# Altium schematic sheet Sheet3.SchDoc
size A3; SheetNumber: 3; SheetTotal: 3
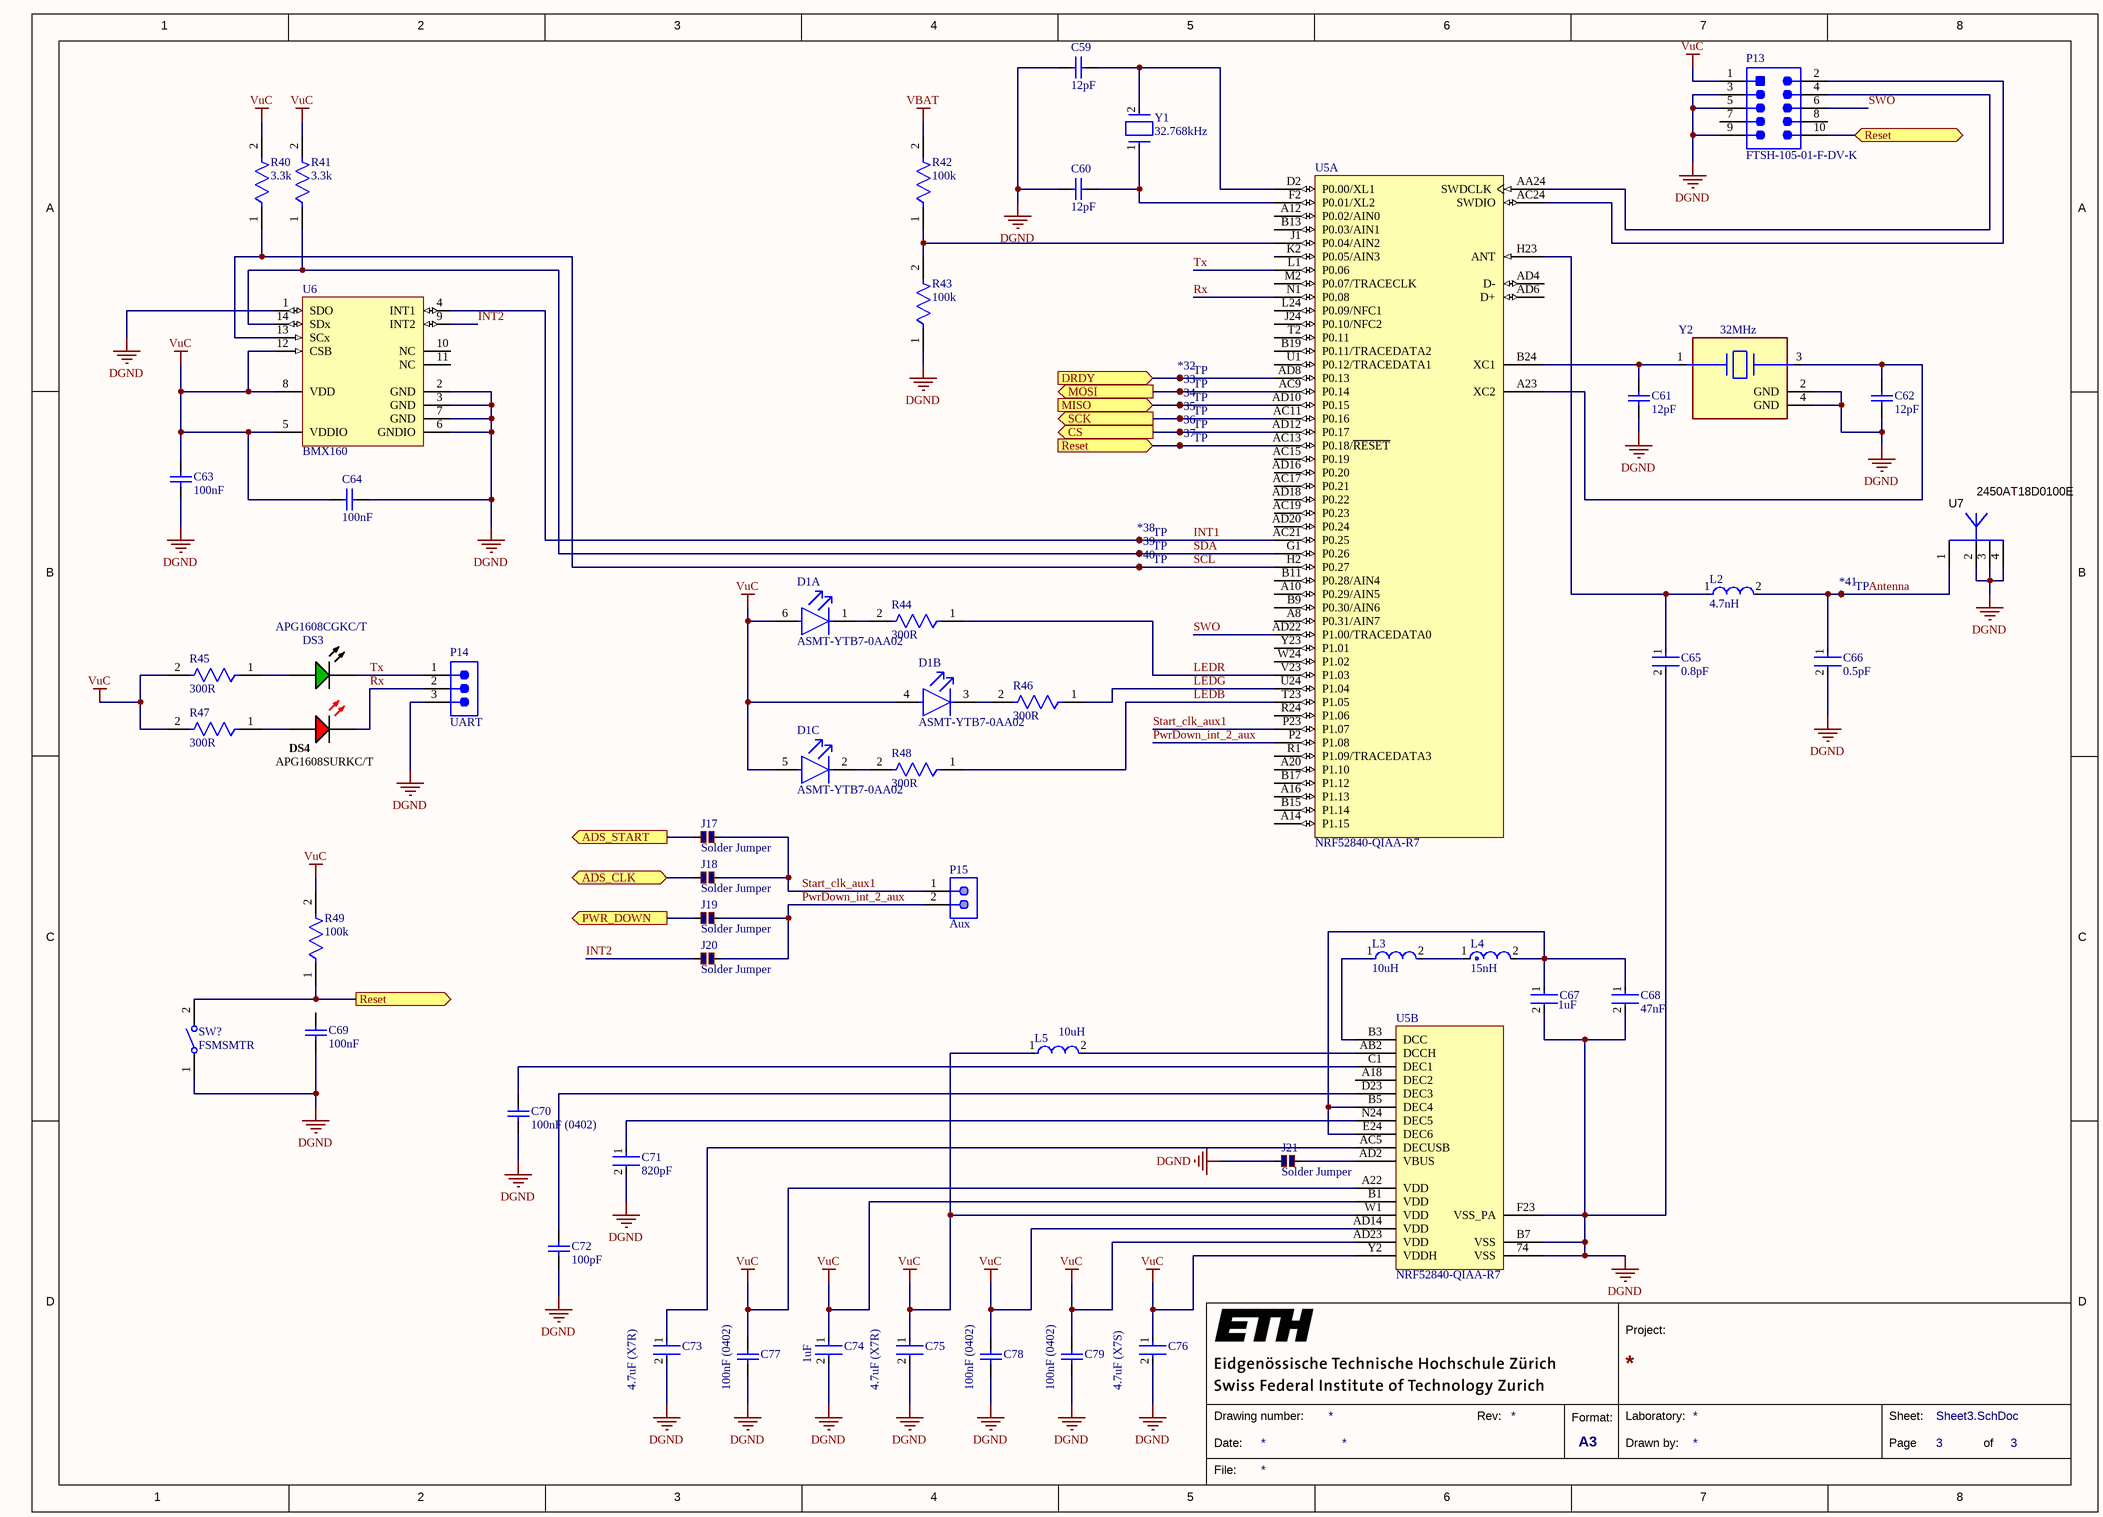
[diagram p0: Sheet3.SchDoc]

## Parts
*32  TP  [Pad-1mm]  (no BOM)
*33  TP  [Pad-1mm]  (no BOM)
*34  TP  [Pad-1mm]  (no BOM)
*35  TP  [Pad-1mm]  (no BOM)
*36  TP  [Pad-1mm]  (no BOM)
*37  TP  [Pad-1mm]  (no BOM)
*38  TP  [Pad-1mm]  (no BOM)
*39  TP  [Pad-1mm]  (no BOM)
*40  TP  [Pad-1mm]  (no BOM)
*41  TP  [Pad-1mm]  (no BOM)
C59  12pF  [CAPC1005X55X25ML05T10]
C60  12pF  [CAPC1005X55X25ML05T10]
C61  12pF  [CAPC1005X55X25ML05T10]
C62  12pF  [CAPC1005X55X25ML05T10]
C63  100nF  [CAPC1608X92X38LL15T08]
C64  100nF  [CAPC1608X92X38LL15T08]
C65  0.8pF  [FP-GJM155-0_05-IPC_A]
C66  0.5pF  [FP-GJM155-0_05-MFG]
C67  1uF  [FP-CL10-IPC_C]
C68  47nF  [FP-GRM155-0_05-IPC_C]
C69  100nF  [CAPC1608X92X38LL15T08]
C70  100nF (0402)  [CAPC1005X55X25ML05T10]
C71  820pF  [FP-GRM155-0_05-IPC_B]
C72  100pF  [CAPC1005X55X10LL05]
C73  4.7uF (X7R)  [FP-CL10-IPC_C]
C74  1uF  [FP-CL10-IPC_C]
C75  4.7uF (X7R)  [FP-CL10-IPC_C]
C76  4.7uF (X7S)  [FP-GRM188-0_15-IPC_A]
C77  100nF (0402)  [CAPC1005X55X25ML05T10]
C78  100nF (0402)  [CAPC1005X55X25ML05T10]
C79  100nF (0402)  [CAPC1005X55X25ML05T10]
D1  ASMT-YTB7-0AA02  [FP-PLCC-6-MFG]  (parts A,B,C of 3)
DS3  APG1608CGKC/T  [KING-LED0603-25-GREEN_V]
DS4  APG1608SURKC/T  [KING-LED0603-25-RED_V]
J17  Solder Jumper  [Small Solder Jumper]
J18  Solder Jumper  [Small Solder Jumper]
J19  Solder Jumper  [Small Solder Jumper]
J20  Solder Jumper  [Small Solder Jumper]
J21  Solder Jumper  [Small Solder Jumper]
L2  4.7nH  [FP-LQW15AN_00-W0_6-0_1-MFG]
L3  10uH  [FP-LQM18FN_00-IPC_C]
L4  15nH  [FP-LQG15HH_02-IPC_B]
L5  10uH  [FP-MLZ1608-MFG]
P13  FTSH-105-01-F-DV-K  [SMTC-FTSH-105-01-L-DV-K_V]
P14  UART  [SMTC-TSW-103-07-X-S]
P15  Aux  [SMTC-TSW-102-07-S-S]
R40  3.3k  [FP-CRCW0603-e3-IPC_A]
R41  3.3k  [FP-CRCW0603-e3-IPC_A]
R42  100k  [FP-CRCW0603-HPe3-IPC_C]
R43  100k  [FP-CRCW0603-HPe3-IPC_C]
R44  300R  [FP-CRCW0603-e3-IPC_A]
R45  300R  [FP-CRCW0603-e3-IPC_A]
R46  300R  [FP-CRCW0603-e3-IPC_A]
R47  300R  [FP-CRCW0603-e3-IPC_A]
R48  300R  [FP-CRCW0603-e3-IPC_A]
R49  100k  [FP-CRCW0603-HPe3-IPC_C]
SW?  FSMSMTR  [TECO-FSMSMTR_V]
U5  NRF52840-QIAA-R7  [NRSC-AQFN-73]  (parts A,B of 2)
U6  BMX160  [LGA-14_2500X3000X860_N]
U7  2450AT18D0100E  [JT-2450AT18D0100E_V]
Y1  32.768kHz  [FP-ECX-34R-MFG]
Y2  32MHz  [FP-402-MFG]

## Ports
ADS_CLK (bidir), ADS_START (out), CS (out), DRDY (in), MISO (in), MOSI (out), PWR_DOWN (out), Reset (bidir), Reset (in), Reset (out), SCK (out)

## Nets
DGND: C59.1 C60.1 C61.1 C62.1 C63.2 C64.2 C65.2 C66.2 C67.2 C68.2 C69.2 C70.1 C71.2 C72.1 C73.2 C74.2 C75.2 C76.2 C77.1 C78.1 C79.1 J21.1 P13.3 P13.5 P13.9 P14.3 R43.1 SW?.1 U5.74(VSS) U5.B7(VSS) U5.F23(VSS_PA) U6.1(SDO) U6.2(GND) U6.3(GND) U6.6(GNDIO) U6.7(GND) U7.2(GND) U7.3(GND) U7.4(GND) Y2.2(GND) Y2.4(GND)
VBAT: R42.2
VuC: C63.1 C64.1 C74.1 C75.1 C76.1 C77.2 C78.2 C79.2 D1.4(Anode(Red)) D1.5(Anode(Green)) D1.6(Anode(Blue)) L5.1 P13.1 R40.2 R41.2 R45.2 R47.2 R49.2 U5.A22(VDD) U5.AD14(VDD) U5.AD23(VDD) U5.B1(VDD) U5.W1(VDD) U5.Y2(VDDH) U6.5(VDDIO) U6.8(VDD) U6.12(CSB)
ADS_CLK: J18.1 ; port ADS_CLK
ADS_START: J17.1 ; port ADS_START
Antenna: *41.1 C66.1 L2.2 U7.1(Feeding_Point)
CS: *36.1 U5.AD12(P0.17) ; port CS
DRDY: *32.1 U5.AD8(P0.13) ; port DRDY
INT1: *38.1 U5.AC21(P0.25) U6.4(INT1)
INT2: J20.1 U6.9(INT2)
LEDB: R48.1 U5.T23(P1.05)
LEDG: R46.1 U5.U24(P1.04)
LEDR: R44.1 U5.V23(P1.03)
MISO: *34.1 U5.AD10(P0.15) ; port MISO
MOSI: *33.1 U5.AC9(P0.14) ; port MOSI
PWR_DOWN: J19.1 ; port PWR_DOWN
PwrDown_int_2_aux: J19.2 J20.2 P15.2 U5.P2(P1.08)
Reset: *37.1 P13.10 R49.1 SW?.2 U5.AC13(P0.18/~{RESET}) ; port Reset
Rx: DS4.2(K) P14.2 U5.N1(P0.08)
SCK: *35.1 U5.AC11(P0.16) ; port SCK
SCL: *40.1 R40.1 U5.H2(P0.27) U6.13(SCx)
SDA: *39.1 R41.1 U5.G1(P0.26) U6.14(SDx)
Start_clk_aux1: J17.2 J18.2 P15.1 U5.P23(P1.07)
SWO: P13.6 U5.AD22(P1.00/TRACEDATA0)
Tx: DS3.2(K) P14.1 U5.L1(P0.06)
NetC59_2: C59.2 U5.D2(P0.00/XL1) Y1.2(Out/In)
NetC60_2: C60.2 U5.F2(P0.01/XL2) Y1.1(In/Out)
NetC61_2: C61.2 U5.B24(XC1) Y2.1
NetC62_2: C62.2 U5.A23(XC2) Y2.3
NetC65_1: C65.1 L2.1 U5.H23(ANT)
NetC67_1: C67.1 C68.1 L4.2 U5.B5(DEC4) U5.E24(DEC6)
NetC70_2: C70.2 U5.C1(DEC1)
NetC71_1: C71.1 U5.N24(DEC5)
NetC72_2: C72.2 U5.D23(DEC3)
NetC73_1: C73.1 U5.AC5(DECUSB)
NetD1_1: D1.1(Cathode(Blue)) R44.2
NetD1_2: D1.2(Cathode(Green)) R48.2
NetD1_3: D1.3(Cathode(Red)) R46.2
NetDS3_1: DS3.1(A) R45.1
NetDS4_1: DS4.1(A) R47.1
NetJ21_2: J21.2 U5.AD2(VBUS)
NetL3_1: L3.1 U5.B3(DCC)
NetL3_2: L3.2 L4.1
NetL5_2: L5.2 U5.AB2(DCCH)
NetP13_2: P13.2 U5.AC24(SWDIO)
NetP13_4: P13.4 U5.AA24(SWDCLK)
NetR42_1: R42.1 R43.2 U5.J1(P0.04/AIN2)

Not connected (* = marked no-connect by the designer): C69 1; P13 7 8; U5 A8(P0.31/AIN7) A10(P0.29/AIN5) A12(P0.02/AIN0) A14(P1.15) A16(P1.13) A18(DEC2) A20(P1.10) AC15(P0.19) AC17(P0.21) AC19(P0.23) AD4(D-) AD6(D+) AD16(P0.20) AD18(P0.22) AD20(P0.24) B9(P0.30/AIN6) B11(P0.28/AIN4) B13(P0.03/AIN1) B15(P1.14) B17(P1.12) B19(P0.11/TRACEDATA2) J24(P0.10/NFC2) K2(P0.05/AIN3) L24(P0.09/NFC1) M2(P0.07/TRACECLK) R1(P1.09/TRACEDATA3) R24(P1.06) T2(P0.11) U1(P0.12/TRACEDATA1) W24(P1.02) Y23(P1.01); U6 10(NC) 11(NC)

## Notes on the sheet
- 1
- 2
- 3
- 4
- 5
- 6
- 7
- 8
- A
- B
- C
- D
- Project:
- Date:
- Drawing number:
- Rev:
- Format:
- A3
- Drawn by:
- Laboratory:
- Page
- Sheet:
- of
- File:

## Library data of the parts
*32-*41 = CMP-01283-1: 1mm SMT Test Pad; Mounting Technology: SMT
C59-C62 = CMP-2008-03945-1: Part Number: GRM1555C1H120GA01D; Manufacturer: Murata
C63 C64 C69 = CMP-1035-02583-2: Manufacturer: Vitramon; Part Number: VJ0603Y104JXJAC
C65 = CMP-2008-03912-2: Multi-Layer Ceramic Capacitor 0.8pF C0G  ±0.1pF 0402 Paper T/R; Voltage: 50V; Height: 0.5mm; Min Operating Temperature: -55°C; Mount: Surface Mount; Length: 1mm; Packaging: Tape and Reel; Package Quantity: 1; Max Operating Temperature: 125°C; Dielectric: C0G; Case Code (Imperial): 0402; Voltage Rating (DC): 50V; Voltage Rating: 50V; Case Code (Metric): 1005; Depth: 0.5mm; Case/Package: 0402; Width: 0.02inch; Termination: SMD/SMT; Thickness: 0.022inch; Capacitance: 0.8pF; Radiation Hardening: No; Lead Free: Lead Free
C66 = CMP-2008-03904-2: Multi-Layer Ceramic Capacitor 0.5pF C0G  ±0.1pF 0402 Paper T/R; Voltage Rating (DC): 50V; Temperature Coefficient: 30ppm/°C; Lead Pitch: 0.3mm; Max Operating Temperature: 125°C; Thickness: 0.022inch; Termination: SMD/SMT; Depth: 0.5mm; Height: 0.5mm; Voltage Rating: 50V; Length: 1mm; Case/Package: 0402; Radiation Hardening: No; Min Operating Temperature: -55°C; Width: 0.02inch; Voltage: 50V; Number of Pins: 2; REACH SVHC: No SVHC; Case Code (Imperial): 0402; Package Quantity: 1; Mount: Surface Mount; Capacitance: 0.5pF; Dielectric: C0G; Lead Free: Lead Free; Case Code (Metric): 1005; Packaging: Tape and Reel
C67 C74 = CMP-13271-003399-1: Cap Ceramic 1uF 10V X5R ±10% Pad SMD 0603 +85°C T/R; Min Operating Temperature: -55°C; Max Operating Temperature: 85°C; Dielectric: X5R; Contact Plating: Tin; Height: 0.8mm; Voltage: 10V; Packaging: Tape and Reel; Voltage Rating: 10V; Capacitance: 1uF; Package Quantity: 1; Width: 0.031inch; Length: 1.6mm; Depth: 0.8mm; Case/Package: 0603; Case Code (Imperial): 0603; Thickness: 0.035inch; Radiation Hardening: No; Tolerance: 10%; Case Code (Metric): 1608; Mount: Surface Mount
C68 = CMP-2008-04032-2: Chip Multilayer Ceramic Capacitors for General Purpose, 0402, 47000pF, X7R, 15%, 10%, 25V; Max Operating Temperature: 125°C; Case/Package: 0402; Length: 1mm; Packaging: Tape and Reel; Mount: Surface Mount; Voltage Rating (DC): 25V; Voltage Rating: 25V; Termination: SMD/SMT; Case Code (Imperial): 0402; Depth: 0.5mm; Tolerance: 10%; Package Quantity: 50000; Width: 0.02inch; Height: 0.5mm; Capacitance: 47nF; Case Code (Metric): 1005; Radiation Hardening: No; Dielectric: X7R; Min Operating Temperature: -55°C; Thickness: 0.022inch
C70 C77-C79 = CMP-2008-04536-1: Part Number: GRM155R60J104KA01D; Manufacturer: Murata
C71 = CMP-1034-01593-3: Chip Multilayer Ceramic Capacitors for General Purpose, 0402, 820pF, C0G, 30ppm/°C, 5%, 50V; Packaging: Tape and Reel; Mount: Surface Mount; Voltage: 50V; Case Code (Metric): 1005; Voltage Rating (DC): 50V; Material: Ceramic; Height: 0.5mm; Length: 1mm; Termination: SMD/SMT; Capacitance: 820pF; Dielectric: C0G; Voltage Rating: 50V; Width: 0.5mm; Min Operating Temperature: -55°C; Depth: 0.5mm; Thickness: 0.022inch; Max Operating Temperature: 125°C; REACH SVHC: No SVHC; Case Code (Imperial): 0402; Lead Free: Lead Free; Radiation Hardening: No; Tolerance: 5%; Temperature Coefficient: 30ppm/°C; Case/Package: 0402; Package Quantity: 1
C72 = CMP-2000-05991-1: Chip Capacitor, 100 pF, +/- 5%, 50 V, -55 to 125 degC, 0402 (1005 Metric), RoHS, Tape and Reel; Manufacturer: TDK; PCN Part Number: MLCCPartNumberChange30/Nov/2012; Voltage - Rated: 50V; Kits: 445-9021-KIT-ND-KITMLCC100PF-10UF04026.3-50V445-9013-KIT-ND-KITMLCC0.50PF-91PF040250V; Temperature Coefficient: C0G,NP0; Other Names: 445-1247-1; Product Training Modules: CSeriesGeneralApplicationsSEAT,CCV,andTVCLDesignToolsGuidetoReplacinganElectrolyticCapacitorwithanMLCC; Online Catalog: CSeries,GeneralPurpose; Datasheet URL: https://product.tdk.com/info/en/catalog/datasheets/mlcc_commercial_general_en.pdf; Lead Style: -; Tolerance: ±5%; Mounting Technology: SurfaceMount; Features: -; Manufacturer URL: http://www.tdk.com/; Datasheet Version: 08/2016; Size / Dimension: 0.039"Lx0.020"W(1.00mmx0.50mm); Applications: GeneralPurpose; Lead Spacing: -; Operating Temperature: -55°C~125°C; Series: C; Capacitance: 100pF; Standard Package: 1; Thickness (Max): 0.022"(0.55mm); Package / Case: 0402(1005Metric); Packaging: CutTape(CT); Category: Capacitors; RoHS Information: RoHSCertificate-MLCC; Mounting Type: SurfaceMount,MLCC; Height - Seated (Max): -; Family: CeramicCapacitors; Package Reference: 1005; Package Description: 2-Pin Surface Mount Device, Body 1 x 0.5 mm; Ratings: -
C73 C75 = CMP-2000-06096-2: CAP CER 4.7UF 6.3V X7R 0603; Manufacturer: Samsung; Manufacturer Part Number: CL10B475KQ8NQNC; Tolerance: 10%; Material: Ceramic; Temperature Coefficient: 15%; Device Class L3: Ceramic Capacitors; Temperature Characteristic: X7R; Automotive: No; Capacitance: 4.7uF; Package: CL10; Device Class L2: Capacitors; Octopart: https://octopart.com/cl10b475kq8nqnc-samsung-24957976; ComponentLink2Description: Datasheet; Temperature Range High: +125°C; Lead Free: Yes; Height: 0.95mm; Temperature: -55°C to +125°C; Ipc Land Pattern Name: CAPC16080X80; Temperature Range Low: -55°C; Digikey Description: CAP CER 4.7UF 6.3V X7R 0603; Mouser Description: C Series 0402 4.7 uF 6.3 V ±20 % Tolerance X5R SMT Multilayer Ceramic Capacitor; Category: Cap; ComponentLink2URL: http://www.samsungsem.com/kr/support/product-search/mlcc/__icsFiles/afieldfile/2018/07/24/CL10B475KQ8NQNC.pdf; Value: 4.7uF; Voltage Rating: 6.3V; Device Class L1: Passive Components; RoHS: TRUE
C76 = CMP-06035-000034-2: CAP CER 4.7UF 10V X7S 0603; Material: Ceramic; Tolerance: 10%; Height: 0.8mm; Termination: SMD/SMT; Case Code (Metric): 1608; Voltage Rating: 10V; Width: 0.8mm; Resistor Type: Ceramic; Length: 1.6mm; Voltage Rating (DC): 10V; Weight: 0.000222oz; Dielectric: X7S; Package Quantity: 4000; Mount: Surface Mount; Case Code (Imperial): 0603; Case/Package: 0603; Packaging: Tape and Reel; Thickness: 0.037inch; Min Operating Temperature: -55°C; Capacitance: 4.7uF; Max Operating Temperature: 125°C
D1 = CMP-18399-000017-1: LED RGB DIFFUSED 6PLCC SMD; Forward Voltage: 3.1V; Test Current: 20mA; Number of LEDs: 3; Luminous Intensity: 384mcd; Viewing Angle: 120°; Color: Blue; Reverse Voltage: 4V; Lens Color: Clear; Dominant Wavelength: 469nm; Packaging: Cut Tape; Min Operating Temperature: -40°C; Weight: 40mg; Lens Transparency: Diffused; Mount: Surface Mount; Forward Current: 20mA; Orientation: Top View; Package Quantity: 2000; Case/Package: PLCC; Length: 3.4mm; Depth: 3mm; REACH SVHC: No SVHC; Number of Elements: 3; Height: 1.8mm; Max Operating Temperature: 100°C; Radiation Hardening: No; Contact Plating: Silver; Number of Pins: 6; Lens Style: Diffused; Width: 2.8mm
DS3 = CMP-0239-00001-1: LED, SMT, 0603(1608), 0.25mm Thickness, Green; Forward Current: 30 mA; Reverse Voltage: 5 V; Power Dissipation: 78 mW; Packing: Reel; ComponentLink1Description: Manufacturer URL; ComponentLink1URL: http://www.kingbrightusa.com/; ComponentLink2URL: http://www.kingbrightusa.com/images/catalog/SPEC/APG1608CGKC-T.pdf; Mounting Technology: Surface Mount; Storage Temperature: -40 to 85 degC; DatasheetVersion: Rev. 5B, 10/2012; PartNumber: APG1608CGKC/T; PackageReference: LED0603-25-GREEN; ComponentLink2Description: Datasheet; PackageDescription: 2-Pin SMT LED, 1.6 x 0.8 mm Body, 0.25mm Thickness; PackageVersion: Rev. 5B, 10/2012
DS4 = CMP-0404-00004-1: Ultra Thin Hyper Red SMD Chip LED Lamp, 2 to 2.5 V, -40 to 85 degC, Body 1.6 x 0.8 mm, 0.28 mm Thickness, RoHS, Tape and Reel; Manufacturer: Kingbright; Dice: Hyper Red (AlGaInP); IR (Max): 10 uA; Luminous Intensity mcd @ 20 mA (Min.): 55; Lens Type: Water Clear; Viewing Angle: 120; Luminous Intensity mcd @ 20 mA (Typ.): 110; ComponentLink2Description: Datasheet; ComponentLink3URL: http://www.kingbrightusa.com/images/catalog/SPEC/APG1608SURKC-T.pdf; Packing: Tape and Reel; Mounting Technology: Surface Mount; PackageVersion: Rev. V.5A; ComponentLink1Description: Manufacturer URL; ComponentLink2URL: http://www.kingbrightusa.com/images/catalog/SPEC/APG1608SURKC-T.pdf; ComponentLink3Description: Package Specification; PackageDescription: 2-Pin SMT, Body 1.6 x 0.8 mm, 0.28mm Thickness, Red; PackageReference: LED0603-25-RED; DatasheetVersion: Rev. V.5A; Operating Temperature: -40 to 85 degC; PartNumber: APG1608SURKC/T; ComponentLink1URL: http://www.kingbrightusa.com/; Forward Voltage: 2 to 2.5 V; RoHS: TRUE
J17-J21 = CMP-00005-5: Value: 1; Technology: SMT
L2 = CMP-06042-000720-1: Wire Wound RF Inductor 4.7nH ±0.5nH 750mA 0.07Ω 0402 (1005); Test Frequency: 100MHz; Core Material: Air; Shielding: Unshielded; Q Factor: 25; Current: 570mA; Tolerance: 5%; DC Resistance (DCR): 70mR; Self Resonant Frequency: 8GHz; Min Operating Temperature: -55°C; Radiation Hardening: No; Depth: 0.7mm; Current Rating: 750mA; Termination: SMD/SMT; Max Operating Temperature: 125°C; Mount: Surface Mount; Case/Package: 0402; Case Code (Metric): 1005; Max DC Current: 750mA; Case Code (Imperial): 0402; Width: 0.5mm; DC Current: 750mA; Height: 0.5mm; Weight: 2.8E-05oz; Packaging: Tape and Reel; Package Quantity: 10000; Military Standard: Not; Length: 1mm; Inductance: 4.7nH
L3 = CMP-06042-016407-1: FIXED IND 10UH 50MA 900 MOHM SMD; Self Resonant Frequency: 30MHz; Tolerance: 20%; DC Resistance (DCR): 1.17R; Core Material: Ferrite; Shielding: Shielded; Test Frequency: 1MHz; Packaging: Tape and Reel; Max DC Current: 50mA; Depth: 0.9mm; DC Current: 50mA; Case/Package: 0603; Saturation Current: 50mA; Height - Seated (Max): 0.035inch; Package Quantity: 4000; Case Code (Metric): 1608; RoHS Compliant: Yes; Military Standard: Not; Current Rating: 50mA; Max Operating Temperature: 125°C; Height: 0.9mm; Inductance: 10uH; Series: LQM18F; Radiation Hardening: No; Lead Free: Lead Free; Termination: SMD/SMT; Length: 0.063inch; Mount: Surface Mount; Case Code (Imperial): 0603; Width: 0.031inch; Min Operating Temperature: -55°C
L4 = CMP-06042-004370-1: Multilayer type RF Inductor 15nH ±5% 0.45Ω 400mA 0402; Current Rating: 300mA; Self Resonant Frequency: 2.3GHz; Core Material: Air; Shielding: Unshielded; DC Resistance (DCR): 460mR; Test Frequency: 100MHz; Q Factor: 8; Inductance: 15nH; Packaging: Tape and Reel; Military Standard: Not; Length: 0.039inch; Termination: SMD/SMT; Radiation Hardening: No; Height - Seated (Max): 0.022inch; DC Current: 300mA; Depth: 0.55mm; Lead Free: Lead Free; Inductance Tolerance: 5%; Min Operating Temperature: -55°C; Max Operating Temperature: 125°C; Case Code (Imperial): 0402; REACH SVHC: No SVHC; Width: 0.5mm; Case Code (Metric): 1005; Package Quantity: 1; Height: 0.5mm; Max DC Current: 300mA; Tolerance: 5%; Mount: Surface Mount; Case/Package: 0402
L5 = CMP-08253-000012-1: FIXED IND 10UH 250MA 1.05 OHM; Manufacturer: TDK; Manufacturer Part Number: MLZ1608M100WT000; Series Resistance: 1.05Ω; Tolerance: 20%; Shielding: true; Core Material: Ferrite; Saturation Current: 90mA; Test Frequency: 2MHz; Digikey Description: FIXED IND 10UH 250MA 1.05 OHM; Inductance: 10uH; Composition: Multilayer; Device Class L3: Fixed Inductors; Temperature: -55°C to +125°C; RoHS: TRUE; Temperature Range High: +125°C; Automotive: No; Device Class L2: Inductors; Value: 10uH; Temperature Range Low: -55°C; Rms Current: 250mA; Category: Ind; Height: 0.95mm; Package: MLZ1608; Device Class L1: Passive Components; Lead Free: Yes; ComponentLink2Description: Datasheet; Octopart: https://octopart.com/mlz1608m100wt000-tdk-22244539; Ipc Land Pattern Name: CAPC16080X80; ComponentLink2URL: https://product.tdk.com/info/en/catalog/datasheets/inductor_commercial_decoupling_mlz1608_en.pdf
P13 = CMP-2000-05352-1: Male Header, Pitch 1.27 mm, 2 x 5 Position, Height 6.12 mm, RoHS, Tube; Manufacturer: Samtec; Number of Positions: 10; Connector Type: Header,Shrouded; Number of Positions Loaded: All; Row Spacing: 0.050"(1.27mm); Fastening Type: -; Package Reference: FTSH-105-01-L-DV-K; Termination: Solder; Package URL: http://suddendocs.samtec.com/prints/ftsh-1xx-xx-xxx-dv-xxx-footprint.pdf; Number of Rows: 2; Contact Finish Thickness: 3µin(0.08µm); Contact Type: MalePin; Manufacturer URL: http://www.samtec.com/; Contact Mating Length: 0.120"(3.05mm); Pitch: 0.050"(1.27mm); Series: FTSH; Features: -; Contact Finish: Gold; Color: Black; Family: RectangularConnectors-Headers,MalePins; Datasheet URL: http://suddendocs.samtec.com/prints/ftsh-1xx-xx-xxx-dv-xxx-mkt.pdf; Package Description: Male Header, Pitch 1.27 mm, 2 x 5 Position, Height 5.97 mm, Tail Length 4.32 mm; Mounting Type: SurfaceMount; Datasheet Version: Rev. ET, 10/1995; Category: Connectors,Interconnects; Packaging: Tube
P14 = CMP-1024-00332-1: 0.025" SQ Post Header, Through-hole, Vertical, -55 to 105 degC, 2.54 mm Pitch, 3-Pin, Male, RoHS; PartNumber: TSW-103-07-T-S; Manufacturer: Samtec; Pitch: 2.54 mm; ComponentLink1URL: http://www.samtec.com; ComponentLink3URL: http://www.samtec.com/documents/webfiles/cpdf/TSW-XXX-XX-XXX-X-XX-XXX-MKT.pdf; Mounting Technology: Through-hole; RoHS: True; DatasheetVersion: F-214; PackageVersion: DM, 8/1988; Temperature Range: -55 to 105 degC; ComponentLink2Description: Datasheet; ComponentLink1Description: Manufacturer URL; Orientation: Vertical; PackageReference: TSW-103-07-X-S; ComponentLink3Description: Package Specification; ComponentLink2URL: http://www.samtec.com/documents/webfiles/pdf/TSW_TH.PDF; PackageDescription: .025[0.64] SQ. Post Terminal Strip Assembly
P15 = CMP-1681-00004-4: Male Header, Pitch 2.54 mm, 1 x 2 Position, Height 8.38 mm, Tail Length 2.54 mm, -55 to 125 degC, RoHS, Bulk; Manufacturer: Samtec; Rows: 1; ComponentLink1URL: http://www.samtec.com/; Contact Finish: Gold; Mounting Technology: Through Hole; PackageReference: TSW-102-07-S-S; RoHSCompliant: true; Pins: 2; Contact Material: Bronze; ComponentLink2Description: Datasheet; Max Operating Temperature: 125 degC; Min Operating Temperature: -55 degC; Height: 8.38 mm; Packaging: Bulk; ComponentLink1Description: Manufacturer URL; PackageDescription: Male Header, Pitch 2.54 mm, 1 x 2 Position, Height 8.38 mm, Tail Length 2.54 mm; Colour: Black; Contact Plating: Gold; Length: 5.08 mm; ComponentLink2URL: http://suddendocs.samtec.com/catalog_english/tsw_th.pdf; DatasheetVersion: 12/2015; Mount: Through Hole; Lead Pitch: 0.1 inch; REACH SVHC: No SVHC; Package Quantity: 1
R40 R41 = CMP-2100-03614-2: RES Thick Film, 3.3kΩ, 1%, 0.1W, 100ppm/°C, 0603; Resistance: 3.3kR; Power Rating: 100mW; Voltage Rating (DC): 75V; Height: 0.45mm; Lead Free: Lead Free; Min Operating Temperature: -55°C; Number of Terminations: 2; Mount: Surface Mount; Max Operating Temperature: 155°C; Package Quantity: 10; Radiation Hardening: No; Features: Automotive AEC-Q200; Depth: 0.85mm; Case Code (Metric): 1608; Termination: SMD/SMT; Width: 0.85mm; Length: 1.55mm; Case Code (Imperial): 0603; Contact Plating: Tin; Temperature Coefficient: 100ppm/°C; Weight: 7.1E-05oz; Packaging: Tape and Reel; Tolerance: 1%; Military Standard: Not; Case/Package: 0603; Working Voltage: 75V; Max Power Dissipation: 100mW; Voltage Rating: 75V; Composition: Thick Film
R42 R43 R49 = CMP-02407-007815-1: RES Thick Film, 100kΩ, 1%, 0.33W, 100ppm/°C, 0603; Power Rating: 250mW; Voltage Rating: 75V; Resistance: 100kR; Min Operating Temperature: -55°C; Case/Package: 0603; Composition: Thick Film; Military Standard: Not; Temperature Coefficient: 100ppm/°C; Lead Free: Lead Free; Weight: 7.1E-05oz; Contact Plating: Tin; Width: 0.8mm; Length: 1.6mm; Radiation Hardening: No; Tolerance: 1%; Case Code (Metric): 1608; Features: Automotive AEC-Q200; Packaging: Tape and Reel; Max Power Dissipation: 250mW; Voltage Rating (DC): 75V; Height: 0.45mm; Case Code (Imperial): 0603; Number of Terminations: 2; Depth: 0.85mm; Max Operating Temperature: 155°C; Package Quantity: 10; Termination: SMD/SMT
R44-R48 = CMP-2000-03216-2: RES Thick Film, 300Ω, 1%, 0.1W, 100ppm/°C, 0603; Voltage Rating (DC): 75V; Power Rating: 100mW; Length: 1.55mm; Height: 0.45mm; Case/Package: 0603; Temperature Coefficient: 100ppm/°C; Packaging: Tape and Reel; Termination: SMD/SMT; Depth: 0.85mm; Max Operating Temperature: 155°C; Radiation Hardening: No; Tolerance: 1%; Lead Free: Lead Free; Case Code (Metric): 1608; Voltage Rating: 75V; Weight: 7.1E-05oz; Package Quantity: 10; Military Standard: Not; Case Code (Imperial): 0603; Resistance: 300R; Composition: Thick Film; Min Operating Temperature: -55°C; Width: 0.033inch; Number of Terminations: 2; Mount: Surface Mount; Features: Automotive AEC-Q200; Contact Plating: Tin; Max Power Dissipation: 100mW
SW? = CMP-2000-07501-1: FSMSM Push Button Switch, 50 mA, -35 to 85 degC, 2-Pin SMD, RoHS, Tape and Reel; Manufacturer: TE Connectivity; Voltage Rating (DC): 24V; Electrical Life: 20000Cycles; Operating Force: 180gf; Switch Travel: 0.25mm; Contact Current Rating: 50mA; Case\/Package: SMD/SMT; Actuator Length: 1.07mm; Throw Configuration: SPST; Actuator Material: Polyamide; Contact Resistance: 100mOhm; Illumination Type: Illuminated; Max Voltage Rating (DC): 12V; Manufacturer URL: http://www.te.com/; Lead Free: LeadFree; Packaging: TapeandReel; Min Operating Temperature: -35degC; Mechanical Life: 20000Cycles; Mount: SurfaceMount; REACH SVHC: Unknown; Package Quantity: 1800; Package Reference: FSMSMTR; RoHSCompliant: true; Max Operating Temperature: 85degC; Orientation: Straight; ELV: Compliant; Datasheet URL: http://www.te.com/commerce/DocumentDelivery/DDEController?Action=showdoc&DocId=Customer+Drawing%7F1437566-3%7FC2%7Fpdf%7FEnglish%7FENG_CD_1437566-3_C2_1437566_3_1_c.dwg.pdf%7F1437566-4; Package Description: 2-Pin Surface Mount Device, Body 6 x 3.5 mm, Pitch 9.19 mm; Current Rating: 50mA; Contact Plating: Silver; Termination: GullWing; Datasheet Version: Rev. C2, 08/2014; Contact Material: Brass; Mounting Technology: SurfaceMount
U5 = CMP-2000-07520-1: RF System on a Chip, 1.7 to 3.6 V, -40 to 85 degC, 73-Pin AQFN, RoHS, Tape and Reel; Manufacturer: Nordic Semiconductor; Package Description: 73-Pin Array Quad Flat No-lead Package, Body 7 x 7 mm, Pitch 0.5 mm; Datasheet Version: Rev. 0.5.1, 07/2017; RoHSCompliant: false; Mounting Technology: SurfaceMount; Manufacturer URL: http://www.nordicsemi.com/eng/Products/; Datasheet URL: http://infocenter.nordicsemi.com/pdf/nRF52840_OPS_v0.5.1.pdf; Package Reference: AQFN
U6 = CMP-01266-1: Accelerometer, Gyroscope, Magnetometer, 9 Axis Sensor I²C, SPI Output; Sensor Type: Accelerometer,Gyroscope,Magnetometer,3 Axis; Output Type: SPI,I2C; Min Operating Temperature: -40°C; Packaging: Tape and Reel; Case/Package: LGA; Max Operating Temperature: 85°C; Mount: Surface Mount; Number of Pins: 14
U7 = CMP-2000-05543-1: Chip RF Antenna, 2.4 to 2.5 GHz, -40 to 125 degC, 4-Pin SMD, RoHS, Tape and Reel; Manufacturer: Johanson Technology; Number of Bands: 1; Gain: 1.5dBi; Return Loss: -10dB; Power - Max: 2W; Frequency Group: UHF(2GHz~3GHz); Online Catalog: JohansonTechnologyInc-Embedded; Frequency (Center/Band): 2.4GHz; Other Names: 712-1573-2; Frequency Range: 2.4GHz~2.5GHz; Series: -; Antenna Type: Chip; Features: -; Applications: -; Category: RF/IFandRFID; Height (Max): 0.047"(1.20mm); Standard Package: 3,000; Package Reference: 2450AT18D0100E; Package Description: 4-Pin Surface Mount Device, Body 3.2 x 1.6 mm; Datasheet Version: Rev. 3.0, 09/2015; Manufacturer URL: https://www.johansontechnology.com/; Datasheet URL: http://www.johansontechnology.com/datasheets/antennas/2450AT18D0100.pdf; Mounting Type: SurfaceMount; Termination: Solder; VSWR: -; Mounting Technology: SurfaceMount; Ingress Protection: -; Family: RFAntennas; Packaging: Tape&Reel(TR)
Y1 = CMP-40224-000012-1: CRYSTAL 32.768KHZ 7PF SMD; Manufacturer Part Number: ECS-.327-7-34R-TR; Manufacturer: ECS Inc.; Tolerance: 20ppm; Esr: 50kΩ; Temperature Range Low: -40°C; Package: ECX-34R; Category: Crys; Load Capacitance: 7pF; Device Class L1: Passive Components; ComponentLink2Description: Datasheet; RoHS: TRUE; Octopart: https://octopart.com/ecs-.327-7-34r-tr-ecs+international-71119730; Temperature: -40°C to +85°C; Series: ECX-34R; Device Class L3: Crystals; Height: 0.9mm; ComponentLink2URL: http://www.ecsxtal.com/store/pdf/ECX_34R.pdf; Device Class L2: Crystals / Oscillators; Lead Free: Yes; Temperature Range High: +85°C; Mouser Description: Crystals 32.768kHz 7pF 20ppm; Frequency: 32.768kHz; Automotive: No; Digikey Description: CRYSTAL 32.768KHZ 7PF SMD
Y2 = CMP-06858-000005-1: CRYSTAL 32.0000MHZ 10PF SMD; Frequency Tolerance: 10ppm; Series Resistance: 100R; Width: 0.063inch; Height: 0.022inch; Length: 0.079inch; Frequency: 32MHz; Contact Plating: Gold; Package Quantity: 3000; Case/Package: SMD/SMT; Frequency Stability: 10ppm; ESR (Equivalent Series Resistance): 100R; Min Operating Temperature: -20°C; Tolerance: 10ppm; Load Capacitance: 10pF; Packaging: Tape and Reel; Max Operating Temperature: 70°C; Mount: Surface Mount; Termination: SMD/SMT